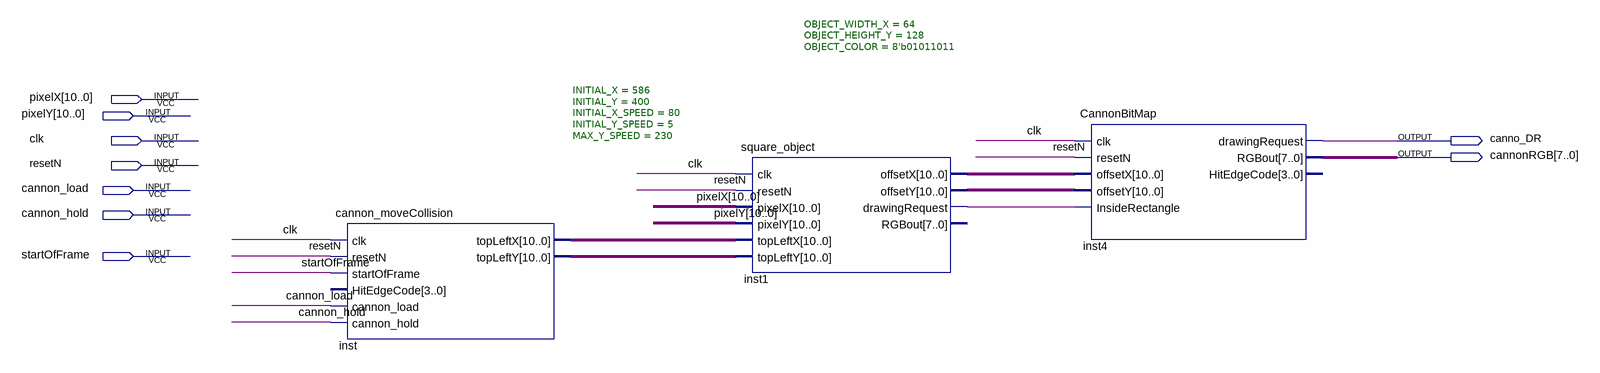
[diagram p0: schematic sheet]
// Quartus schematic cannon_block.bdf as structural Verilog: 3 symbols, 9 pins
module cannon_block (
  input  [10:0] pixelX,
  input  [10:0] pixelY,
  input  clk,
  input  resetN,
  input  cannon_load,
  input  cannon_hold,
  input  startOfFrame,
  output canno_DR,
  output [7:0] cannonRGB
);

  wire inst1_drawingrequest;
  wire [10:0] inst1_offsetx, inst1_offsety, inst_topleftx, inst_toplefty;

  cannon_moveCollision #(.INITIAL_X(586), .INITIAL_Y(400), .INITIAL_X_SPEED(80), .INITIAL_Y_SPEED(5), .MAX_Y_SPEED(230)) inst (
    .clk(clk), .resetN(resetN), .startOfFrame(startOfFrame), .cannon_load(cannon_load),
    .cannon_hold(cannon_hold), .topLeftX(inst_topleftx), .topLeftY(inst_toplefty));  // open: HitEdgeCode
  square_object #(.OBJECT_WIDTH_X(64), .OBJECT_HEIGHT_Y(128), .OBJECT_COLOR(8'b01011011)) inst1 (
    .clk(clk), .resetN(resetN), .pixelX(pixelX), .pixelY(pixelY), .topLeftX(inst_topleftx),
    .topLeftY(inst_toplefty), .offsetX(inst1_offsetx), .offsetY(inst1_offsety),
    .drawingRequest(inst1_drawingrequest));  // open: RGBout
  CannonBitMap inst4 (
    .clk(clk), .resetN(resetN), .offsetX(inst1_offsetx), .offsetY(inst1_offsety),
    .InsideRectangle(inst1_drawingrequest), .drawingRequest(canno_DR), .RGBout(cannonRGB));  // open: HitEdgeCode
endmodule
